# Altium project PCB_Project.PrjPcb
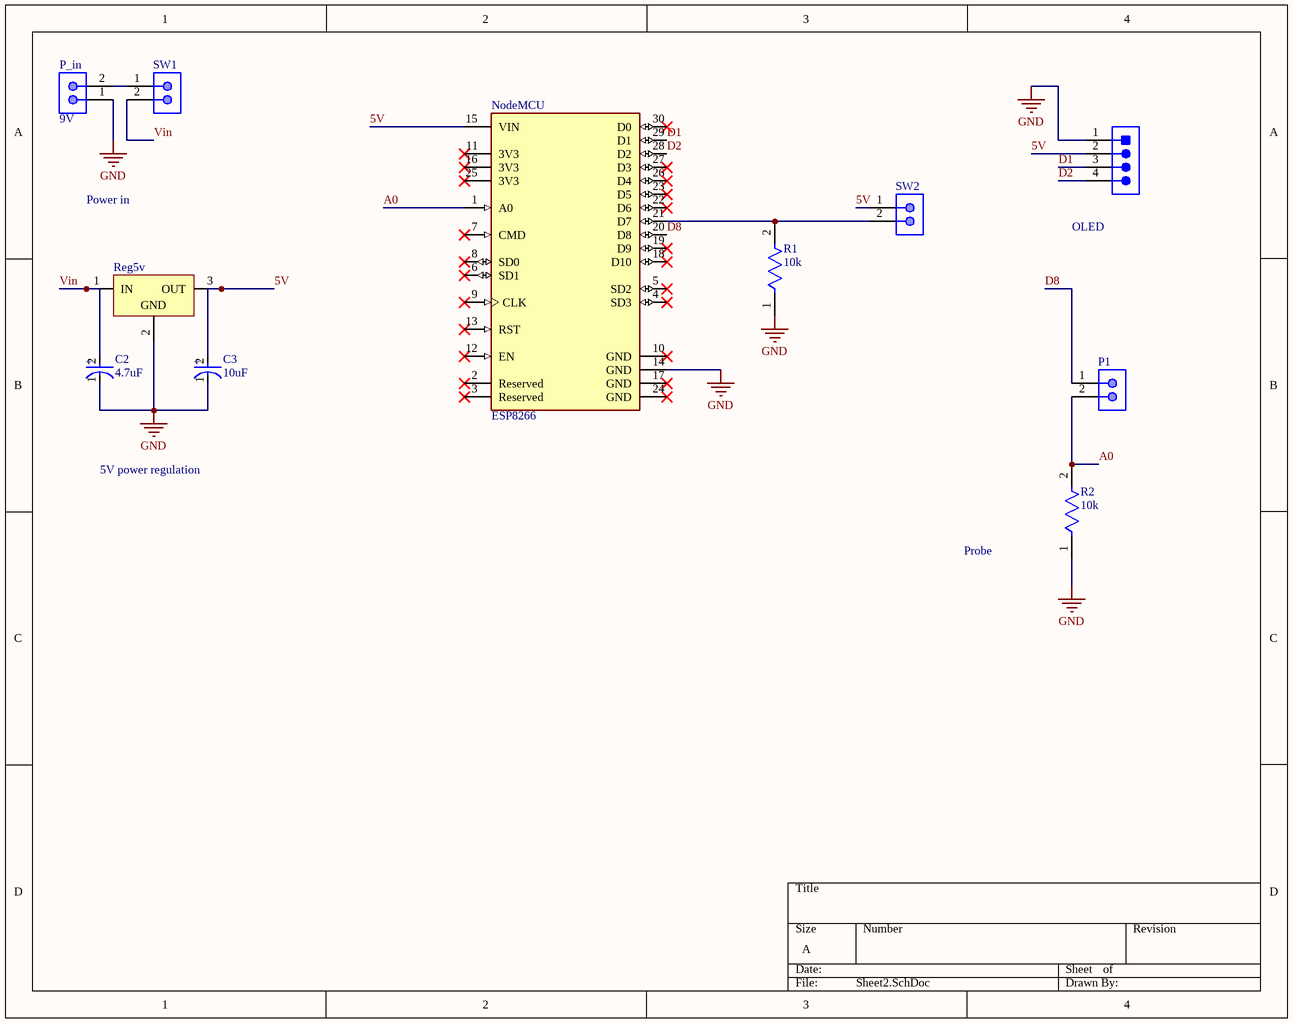
[diagram p0: Sheet2.SchDoc]
1 sheet, 11 parts. Net scope: global (net labels, ports and power ports of the same name join across sheets).
Board file: PCB1.PcbDoc

## Sheet Sheet2.SchDoc
size A; SheetNumber: 1; SheetTotal: 1

### Parts
C2  4.7uF  [FP-RAD-TH-D_6_3_0_5-L_11-MFG]
C3  10uF  [FP-RAD-TH-D_5_0_5-L_11_1-MFG]
NodeMCU  ESP8266  [FP-113990105-MFG]
OLED  6  [TECO-640456-4]  (value not drawn)
P1  5-146280-2  [TECO-5-146280-2_V]  (value not drawn)
P_in  9V  [MOLX-22-27-2021_V]
R1  10k  [FP-CF18-MFG]
R2  10k  [FP-CF18-MFG]
Reg5v  5V  [TO220]  (value not drawn)
SW1  5-146280-2  [TECO-5-146280-2_V]  (value not drawn)
SW2  5-146280-2  [TECO-5-146280-2_V]  (value not drawn)

### Nets
GND: C2.1(C) C3.1(C) NodeMCU.14(GND) OLED.1 P_in.1 R1.1 R2.1 Reg5v.2(GND)
5V: C3.2(A) NodeMCU.15(VIN) OLED.2 Reg5v.3(OUT) SW2.1
A0: NodeMCU.1(A0) P1.2 R2.2
D1: NodeMCU.29(D1) OLED.3
D2: NodeMCU.28(D2) OLED.4
D8: NodeMCU.20(D8) P1.1
Vin: C2.2(A) Reg5v.1(IN) SW1.2
NetNodeMCU_21: NodeMCU.21(D7) R1.2 SW2.2
NetP_in_2: P_in.2 SW1.1

Not connected (* = marked no-connect by the designer): NodeMCU 2(Reserved)* 3(Reserved)* 4(SD3)* 5(SD2)* 6(SD1)* 7(CMD)* 8(SD0)* 9(CLK)* 10(GND)* 11(3V3)* 12(EN)* 13(RST)* 16(3V3)* 17(GND)* 18(D10)* 19(D9)* 22(D6)* 23(D5)* 24(GND)* 25(3V3)* 26(D4)* 27(D3)* 30(D0)*

### Notes on the sheet
- Power in
- 5V power regulation
- Probe
- (in symbol CMP-05427-000237-1) +
- (in symbol CMP-05427-000869-1) +

### Library data of the parts
C2 = CMP-05427-000237-1: Aluminum Electrolytic Capacitors (Radial Lead Type) 4.7uF ±20% 160V; Life (Hours): 2000Hour; Ripple Current: 43mA; Dielectric Material: Aluminium; Lead/Base Style: Straight; Lead Diameter: 0.5mm; Dissipation Factor: 0.15%; Height - Seated (Max): 0.48inch; Voltage: 160V; REACH SVHC: No SVHC; Package Quantity: 200; Length: 11.2mm; Termination: Radial; Weight: 0.01lb; Construction: RADIAL; Voltage Rating (DC): 160V; Number of Pins: 2; Voltage Rating: 160V; Min Operating Temperature: -25°C; Packaging: Bulk; Radiation Hardening: No; Series: NHG; Max Operating Temperature: 105°C; Height: 11.2mm; Mount: Through Hole; Tolerance: 20%; Capacitance: 4.7uF; Width: 0.25inch; Lead Pitch: 2.5mm; Diameter: 6.3mm; Ripple Current (AC): 43mA; Case/Package: Radial; Lead Free: Lead Free; RoHS Compliant: Yes
C3 = CMP-05427-000869-1: Aluminum Electrolytic Capacitors (Radial Lead Type) 10uF ±20% 100V; Polarity: Polar; Lead Diameter: 0.5mm; Dissipation Factor: 0.1%; Leakage Current: 3uA; Dielectric Material: Aluminium; Ripple Current: 70mA; Life (Hours): 2000Hour; Lead/Base Style: Straight; Length: 11mm; Case/Package: Radial; Lead Pitch: 2mm; Contact Plating: Tin; RoHS Compliant: Yes; Radiation Hardening: No; Capacitance: 10uF; Max Operating Temperature: 85°C; Lead Free: Lead Free; Termination: Radial; Voltage Rating: 100V; Package Quantity: 200; Voltage: 100V; Construction: RADIAL; Height: 11mm; Min Operating Temperature: -40°C; Diameter: 5mm; REACH SVHC: No SVHC; Tolerance: 20%; Width: 5mm; Height - Seated (Max): 0.472inch; Mount: Through Hole; Series: M; Voltage Rating (DC): 100V; Packaging: Bulk; Ripple Current (AC): 70mA; Number of Pins: 2
NodeMCU = CMP-138991-000001-1: NODEMCU V2 LUA BASED ESP8266 DEV; Manufacturer: Seeed Studio; Manufacturer Part Number: 113990105; Frequency: 2.4GHz; Series: -
OLED = CMP-2000-05419-1: Male Header, Pitch 2.54 mm, 1 x 4 Position, Height 10.03 mm, Tail Length 3.56 mm, RoHS, Bulk; Manufacturer: TE Connectivity; Manufacturer Part Number: 640456-4; Material, Housing: Polyester; Primary Type: InterconnectSystem; Mount Angle: Vertical; Color, Housing: White; Current, Rating: 5 / A; Agency Approvals: CSA,UL; Contact Termination Area Plating: Tin; Temperature, Operating: -55to+105 / degC; Standards: RoHSCompliant,ELVCompliant,UL94V-0; Number of Positions: 4; Brand/Series: MTA-100Series; Angle: Straight; Pin Spacing: 0.1 / "; Material, Contact: CopperAlloy; Connector Type: MTA-100; Special Features: Pinstrip; Mounting Hole Size: 0.04 / "; Contact Centerline Spacing: 0.100 / in.; Voltage, Rating: 250 / V; Manufacturer URL: http://www.te.com/; Length, Pin: 0.14 / "; Length, Overall: 0.4 / "; Color: White; Flammability Rating: UL94V-0; Mounting Type: PCMount; Termination: Solder; Datasheet URL: https://datasheet.ciiva.com/16286/eng-ds-82056-mta-0608-16286228.pdf; Number of Contacts: 4; Contact Shape: Square; Contact Mating Area Plating: Tin; Length, Terminal Post: 0.14 / in.; Size, Post: 0.025 / in.; Contact Plating: Tin; Type: PCBPlug; Datasheet Version: Dec-14; Number of Rows: 1
P1 SW1 SW2 = CMP-2000-07492-1: Male Header, Pitch 2.54 mm, 1 x 2 Position, Height 8.21 mm, Tail Length 3.05 mm, -65 to 105 degC, RoHS, Bulk; Manufacturer: TE Connectivity; Mating Connector Lock: No(Without); Number of Positions: 2; Pitch: 2.54mm; PCB Mounting Orientation: Vertical; Keyed: No; Case\/Package: 100; Mating Post Length: 0.23inch; High Temperature Housing: Yes; Max Current Rating: 5A; PCB Thickness: 0.063inch; PCB Mount Retention: Without; Approvals: CSA; Current Rating: 3A; Radiation Hardening: No; Length: 4.67mm; Contact Mating Length: 0.23inch; Connector Type: Header; Number of Rows: 1; Termination Post Length: 0.12inch; Board Standoff: No(Without); Max Operating Temperature: 105degC; Contact Shape: Square; Selectively Loaded: No(Without); Gasket: No(Without); Number of Contacts: 2; Contact Gender: Male; Mating Alignment: No(Without); Manufacturer URL: http://www.te.com/; Datasheet URL: http://www.te.com/commerce/DocumentDelivery/DDEController?Action=showdoc&DocId=Customer+Drawing%7F146280%7FH1%7Fpdf%7FEnglish%7FENG_CD_146280_H1.pdf%7F5-146280-2; Mount: ThroughHole; Orientation: Straight; Packaging: Carton; Package Reference: 5-146280-2; Package Quantity: 500; Stabilizers: No(Without); Row Spacing: 2.54mm; Contact Material: CopperAlloy; Panel Mount Retention: No(Without); Datasheet Version: Rev. H1, 08/2016; Housing Colour: Black; Colour: Black; Package Description: Male Header, Pitch 2.54 mm, 1 x 2 Position, Height 8.21 mm, Tail Length 3.05 mm; Contact Plating: Matte; Housing Material: Polymer; Contact Protection: No(Without); Min Operating Temperature: -65degC; Mounting Technology: ThroughHole; Flammability Rating: UL94V-0; RoHSCompliant: true; Termination: ThroughHole; Depth: 2.34mm; High Speed Serial Data Connector: No
P_in = CMP-2000-05537-1: Male Header, Pitch 2.54 mm, 1 x 2 Position, Height 11.7 mm, Tail Length 3.56 mm, 0 to 75 degC, RoHS, Bulk; Manufacturer: Molex; PartNumber: 0022272021; Current rating: 4A; Package Version: Rev. BC, 02/2012; Voltage rating: 250V; No. of Positions: 2; Pitch: 2.54mm; No. of Rows: 1; Orientation: Vertical; Operating temperature: 0°Cto+75°C; Manufacturer URL: http://www.molex.com/; Mounting Technology: ThroughHole; Housing material: Nylon(UL94V-0); Package Description: 2-Leads Header, Body 5.08 x 5.8 mm, Pitch 2.54 mm; Voltage - Max: 250V; Datasheet URL: http://www.molex.com/pdm_docs/sd/022272021_sd.pdf; Package Reference: 22-27-2021; Contact material: Tinplatedbrass; Current - Max: 4A; Datasheet Version: Rev. F, 06/2009
R1 R2 = CMP-26528-000002-1: RES 10K OHM 1/8W 5% CF AXIAL; Manufacturer Part Number: CF18JT10K0; Manufacturer: Stackpole Electronics; Power Rating: 0.125W; Temperature Coefficient: 0-500ppm/°C; Resistance: 10kΩ; Voltage Rating: 250V; Value: 10kΩ; Temperature: -55°C to +155°C; Height: 2mm; Lead Free: Yes; Automotive: No; Device Class L2: Resistors; Package: CF18; Series: CF; ComponentLink2Description: Datasheet; Ipc Land Pattern Name: RESAD656W65L360D200; Temperature Range High: +155°C; RoHS: TRUE; Device Class L3: Through-Hole Resistors; Temperature Range Low: -55°C; Device Class L1: Passive Components; Category: Res; Octopart: https://octopart.com/cf18jt10k0-stackpole+electronics-19205642; Composition: Carbon Film; Digikey Description: RES 10K OHM 1/8W 5% CF AXIAL; ComponentLink2URL: http://www.seielect.com/Catalog/SEI-CF_CFM.pdf; Tolerance: 5%
Reg5v = CMP-0244-00495-1: Positive Voltage Regulator, 6V, 3-Pin TO-220; PackageDescription: TO, Thru-Hole, Vertical, Heatsink Mounted; 3 In-Line Leads; Pitch 2.54 mm; ComponentLink3Description: Package Specification; PackageReference: TO220; PackageVersion: ver3.0; DatasheetVersion: 16/11/2011; ComponentLink3URL: http://www.st.com/internet/com/TECHNICAL_RESOURCES/TECHNICAL_LITERATURE/PACKAGE_INFORMATION/CD00004649.pdf; ComponentLink2Description: Datasheet; ComponentLink2URL: http://www.st.com/internet/com/TECHNICAL_RESOURCES/TECHNICAL_LITERATURE/DATASHEET/CD00000444.pdf; ComponentLink1Description: Manufacturer URL; ComponentLink1URL: http://www.st.com